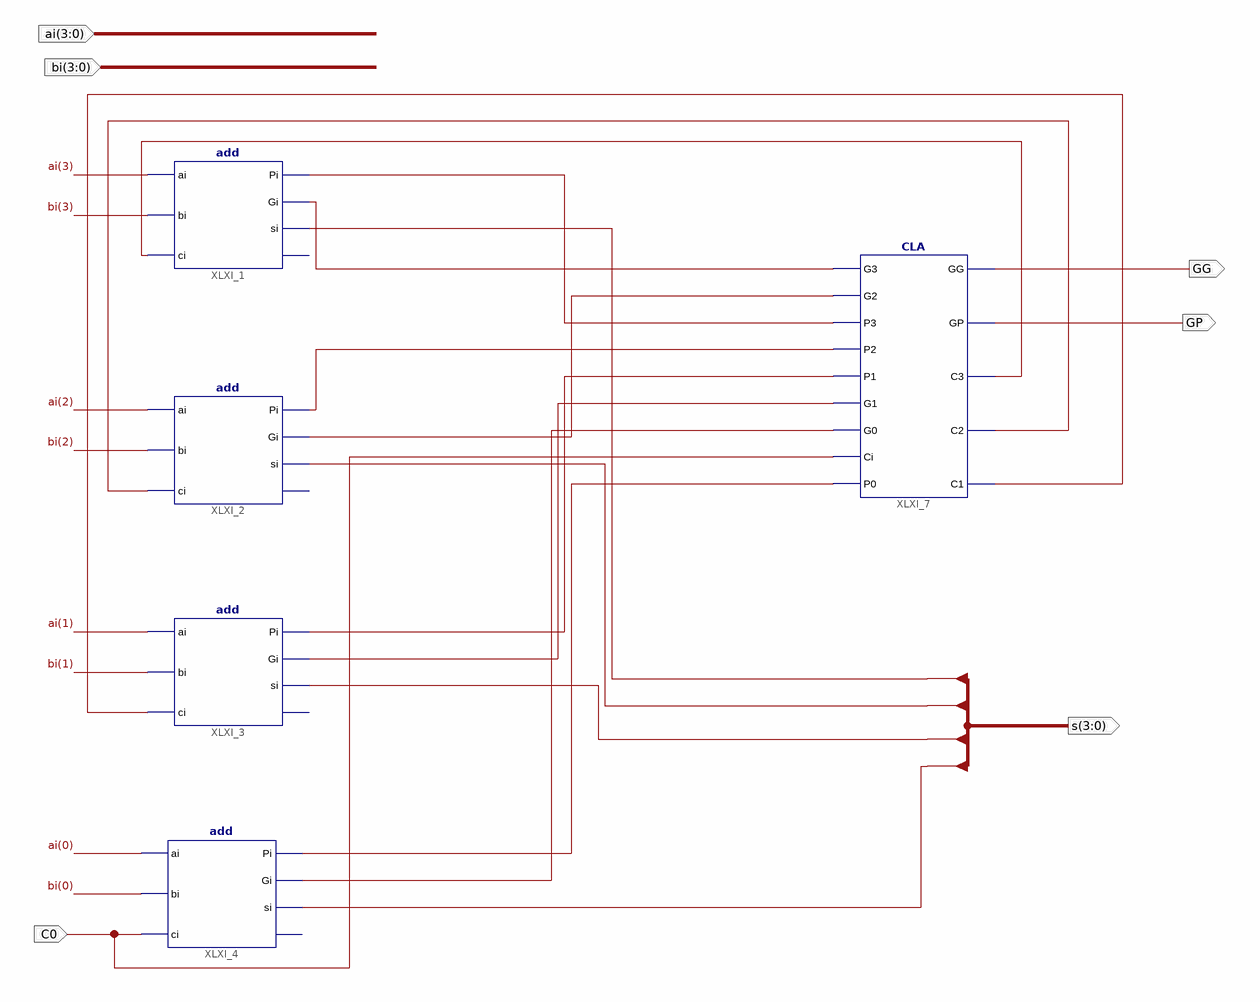
[diagram p0: schematic sheet 1]
// Xilinx ISE schematic add4b.sch (kintex7) as structural Verilog: 5 symbols, 6 ports
module add4b (
  input  [3:0] ai,
  input  [3:0] bi,
  input  C0,
  output [3:0] s,
  output GG,
  output GP
);

  wire XLXN_5, XLXN_6, XLXN_7, XLXN_8, XLXN_15, XLXN_16, XLXN_17, XLXN_18, XLXN_31, XLXN_35, XLXN_36;

  add XLXI_1 (.ai(ai[3]), .bi(bi[3]), .ci(XLXN_31), .Pi(XLXN_15), .Gi(XLXN_5), .si(s[3]));  // open: co
  add XLXI_2 (.ai(ai[2]), .bi(bi[2]), .ci(XLXN_35), .Pi(XLXN_16), .Gi(XLXN_6), .si(s[2]));  // open: co
  add XLXI_3 (.ai(ai[1]), .bi(bi[1]), .ci(XLXN_36), .Pi(XLXN_17), .Gi(XLXN_7), .si(s[1]));  // open: co
  add XLXI_4 (.ai(ai[0]), .bi(bi[0]), .ci(C0), .Pi(XLXN_18), .Gi(XLXN_8), .si(s[0]));  // open: co
  CLA XLXI_7 (
    .P0(XLXN_18), .Ci(C0), .G0(XLXN_8), .G1(XLXN_7), .P1(XLXN_17), .P2(XLXN_16), .P3(XLXN_15), .G2(XLXN_6),
    .G3(XLXN_5), .C1(XLXN_36), .C2(XLXN_35), .C3(XLXN_31), .GP(GP), .GG(GG));
endmodule
